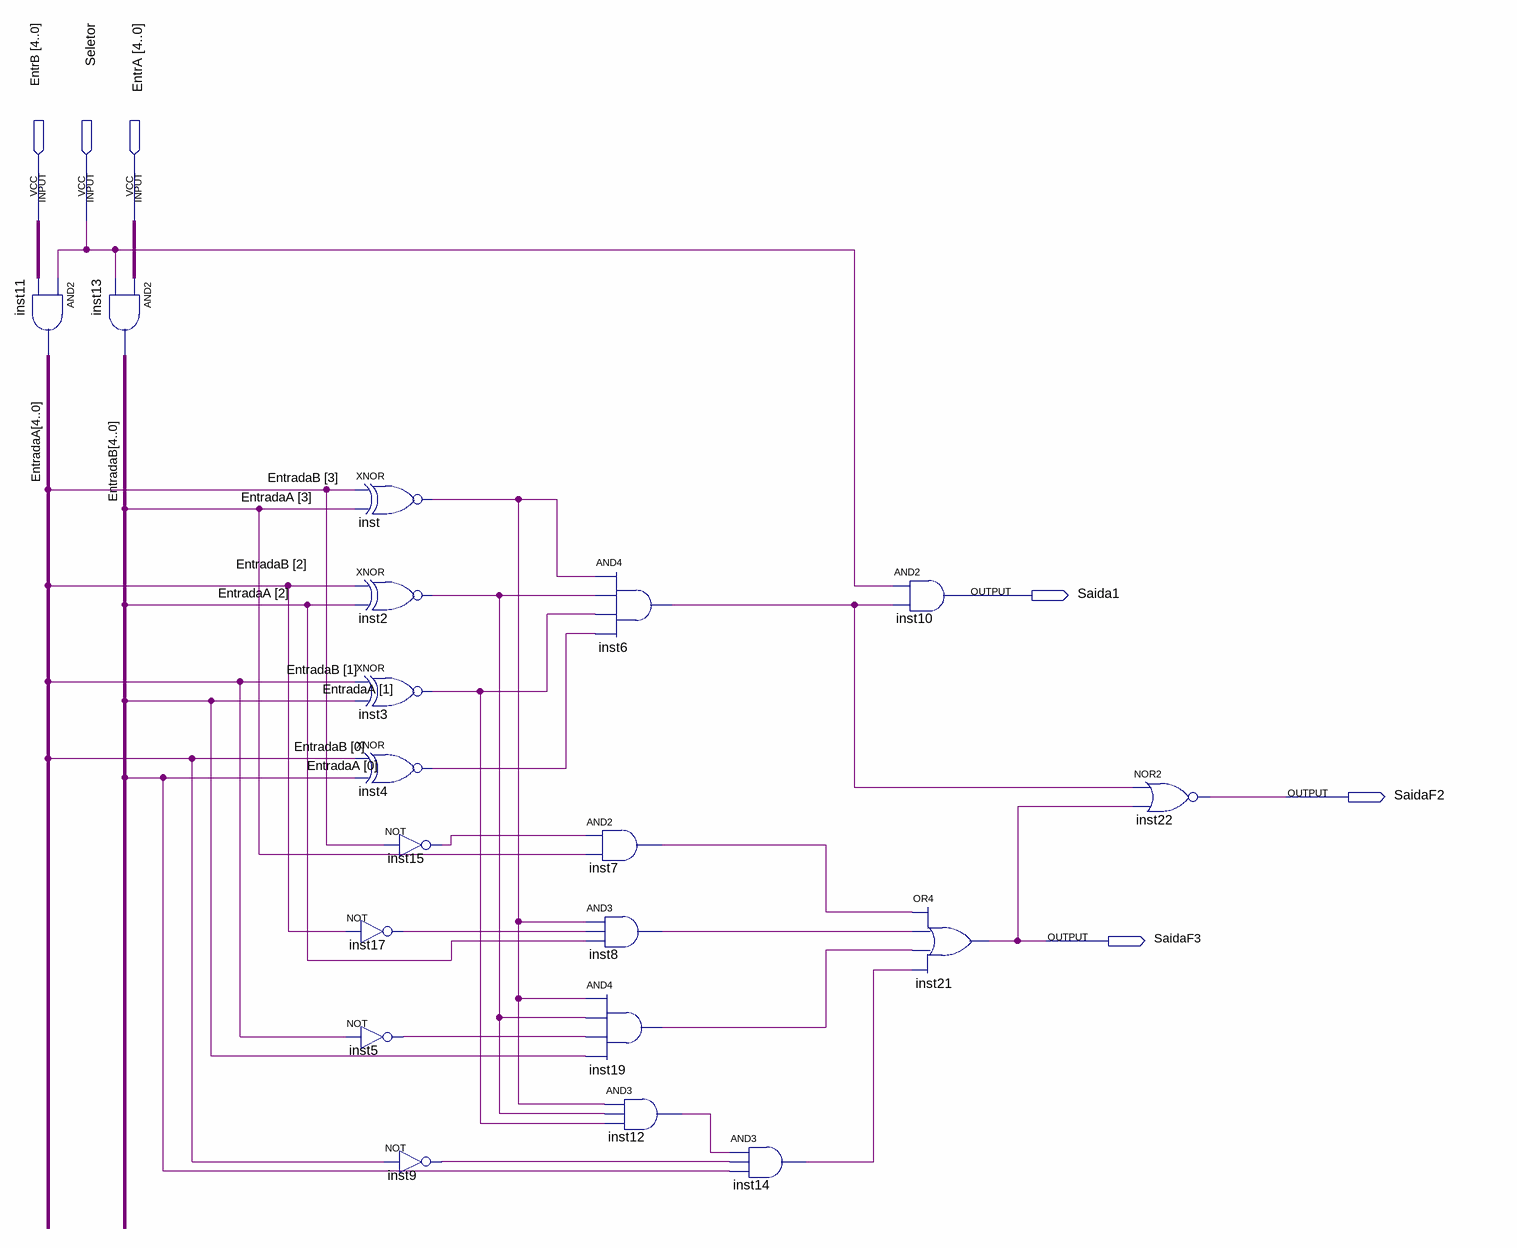
[diagram p0: schematic sheet]
// Quartus schematic Comp11.bdf as structural Verilog: 19 symbols, 6 pins
module Comp11 (
  input  [4:0] EntrB,
  input  Seletor,
  input  [4:0] EntrA,
  output Saida1,
  output SaidaF2,
  output SaidaF3
);

  wire inst2_out, inst3_out, inst4_out, inst5_out, inst6_out, inst7_out, inst8_out, inst9_out, inst12_out,
       inst14_out, inst15_out, inst17_out, inst19_out, inst_out;
  wire [4:0] EntradaA, EntradaB;

  assign EntradaA = {5{Seletor}} & EntrB;  // AND2 inst11, 5 bits wide
  assign EntradaB = EntrA & {5{Seletor}};  // AND2 inst13, 5 bits wide
  xnor inst (inst_out, EntradaB[3], EntradaA[3]);
  xnor inst2 (inst2_out, EntradaB[2], EntradaA[2]);
  xnor inst3 (inst3_out, EntradaB[1], EntradaA[1]);
  xnor inst4 (inst4_out, EntradaB[0], EntradaA[0]);
  not inst15 (inst15_out, EntradaB[3]);
  not inst17 (inst17_out, EntradaB[2]);
  not inst5 (inst5_out, EntradaB[1]);
  not inst9 (inst9_out, EntradaB[0]);
  and inst6 (inst6_out, inst_out, inst2_out, inst3_out, inst4_out);
  and inst7 (inst7_out, inst15_out, EntradaA[3]);
  and inst8 (inst8_out, inst_out, inst17_out, EntradaA[2]);
  and inst19 (inst19_out, inst_out, inst2_out, inst5_out, EntradaA[1]);
  and inst12 (inst12_out, inst_out, inst2_out, inst3_out);
  and inst14 (inst14_out, inst12_out, inst9_out, EntradaA[0]);
  and inst10 (Saida1, Seletor, inst6_out);
  or inst21 (SaidaF3, inst7_out, inst8_out, inst19_out, inst14_out);
  nor inst22 (SaidaF2, inst6_out, SaidaF3);
endmodule
